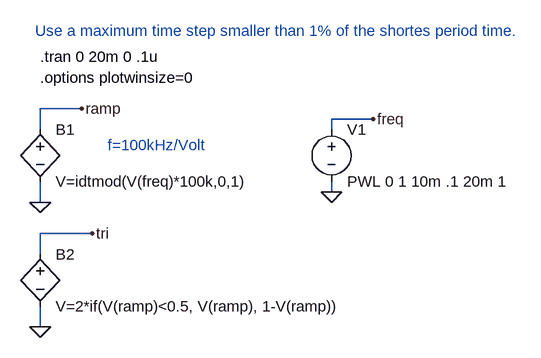
[diagram p0: schematic triangle_osc_fm2.asc]
triangle_osc_fm2.asc, the LTspice schematic file:
Version 4
SHEET 1 1632 680
WIRE -432 64 -496 64
WIRE 16 80 -48 80
WIRE -496 96 -496 64
WIRE -48 96 -48 80
WIRE -48 192 -48 176
WIRE -496 208 -496 176
WIRE -416 256 -496 256
WIRE -496 288 -496 256
WIRE -496 400 -496 368
FLAG -48 192 0
FLAG 16 80 freq
FLAG -496 208 0
FLAG -432 64 ramp
FLAG -496 400 0
FLAG -416 256 tri
SYMBOL bv -496 80 R0
SYMATTR InstName B1
SYMATTR Value V=idtmod(V(freq)*100k,0,1)
SYMBOL voltage -48 80 R0
WINDOW 123 0 0 Left 0
WINDOW 39 0 0 Left 0
SYMATTR InstName V1
SYMATTR Value PWL 0 1 10m .1 20m 1
SYMBOL bv -496 272 R0
SYMATTR InstName B2
SYMATTR Value V=2*if(V(ramp)<0.5, V(ramp), 1-V(ramp))
TEXT -496 -16 Left 0 !.tran 0 20m 0 .1u
TEXT -496 16 Left 0 !.options plotwinsize=0
TEXT -504 -56 Left 0 ;Use a maximum time step smaller than 1% of the shortes period time.
TEXT -392 120 Left 0 ;f=100kHz/Volt

The netlist it stands for:
* triangle_osc_fm2.asc
B1 ramp 0 V=idtmod(V(freq)*100k,0,1)
V1 freq 0 PWL 0 1 10m .1 20m 1
B2 tri 0 V=2*if(V(ramp)<0.5, V(ramp), 1-V(ramp))
.tran 0 20m 0 .1u
.options plotwinsize=0
* Use a maximum time step smaller than 1% of the shortes period time.
* f=100kHz/Volt
.backanno
.end